# Altium schematic sheet RS485.SchDoc
size A4
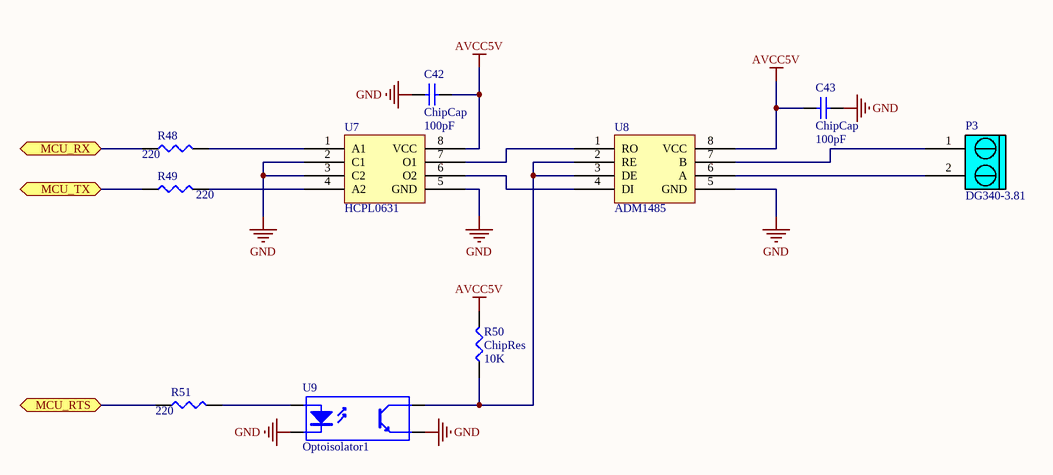
[diagram p0: RS485.SchDoc]

## Parts
C42  ChipCap  value 100pF  [CAP0805]
C43  ChipCap  value 100pF  [CAP0805]
P3  DG340-3.81  [DG340-3.81-02P-00A(H)]
R48  value 220  [RES0805]  (hidden comment: ChipRes)
R49  value 220  [RES0805]  (hidden comment: ChipRes)
R50  ChipRes  value 10K  [RES0805]
R51  value 220  [RES0805]  (hidden comment: ChipRes)
U7  HCPL0631  [SOIC8]
U8  ADM1485  [SO-8_L]
U9  Optoisolator1  [DIP-4]

## Ports
MCU_RTS, MCU_RX, MCU_TX

## Nets
AVCC5V: C42.2 C43.1 R50.2 U7.8(VCC) U8.8(VCC)
GND: C42.1 C43.2 U7.2(C1) U7.3(C2) U7.5(GND) U8.5(GND) U9.2(K) U9.3(E)
MCU_RTS: R51.1 ; port MCU_RTS
MCU_RX: R48.1 ; port MCU_RX
MCU_TX: R49.1 ; port MCU_TX
NetP3_1: P3.1 U8.7(B)
NetP3_2: P3.2 U8.6(A)
NetR48_2: R48.2 U7.1(A1)
NetR49_2: R49.2 U7.4(A2)
NetR50_1: R50.1 U8.2(RE) U8.3(DE) U9.4(C)
NetR51_2: R51.2 U9.1(A)
NetU7_6: U7.6(O2) U8.4(DI)
NetU7_7: U7.7(O1) U8.1(RO)

## Library data of the parts
C42 C43 = ChipCap: Capacitor; Published: 8-Jun-2000; LatestRevisionDate: 17-Jul-2002; LatestRevisionNote: Re-released for DXP Platform.; PackageReference: RAD-0.3; Publisher: Altium Limited
P3 = DG340-3.81-02P: Terminal block
R48-R51 = ChipRes: Chip resistor
U7 = HCPL0631: 2-channel opto-coupler
U8 = ADM1485: 5 V Low Power  EIA RS-485 Transceiver
U9 = Optoisolator1: 4-Pin Phototransistor Optocoupler; Published: 24-Mar-1999; LatestRevisionDate: 04-Mar-2005; LatestRevisionNote: Sch pins 3 & 4 Swapped.; DatasheetVersion: Nov-2003; PackageReference: DIP-4; Publisher: Altium Limited